# EAGLE design coolRoof_concentrateur_exterieur (EAGLE 8.4.0)
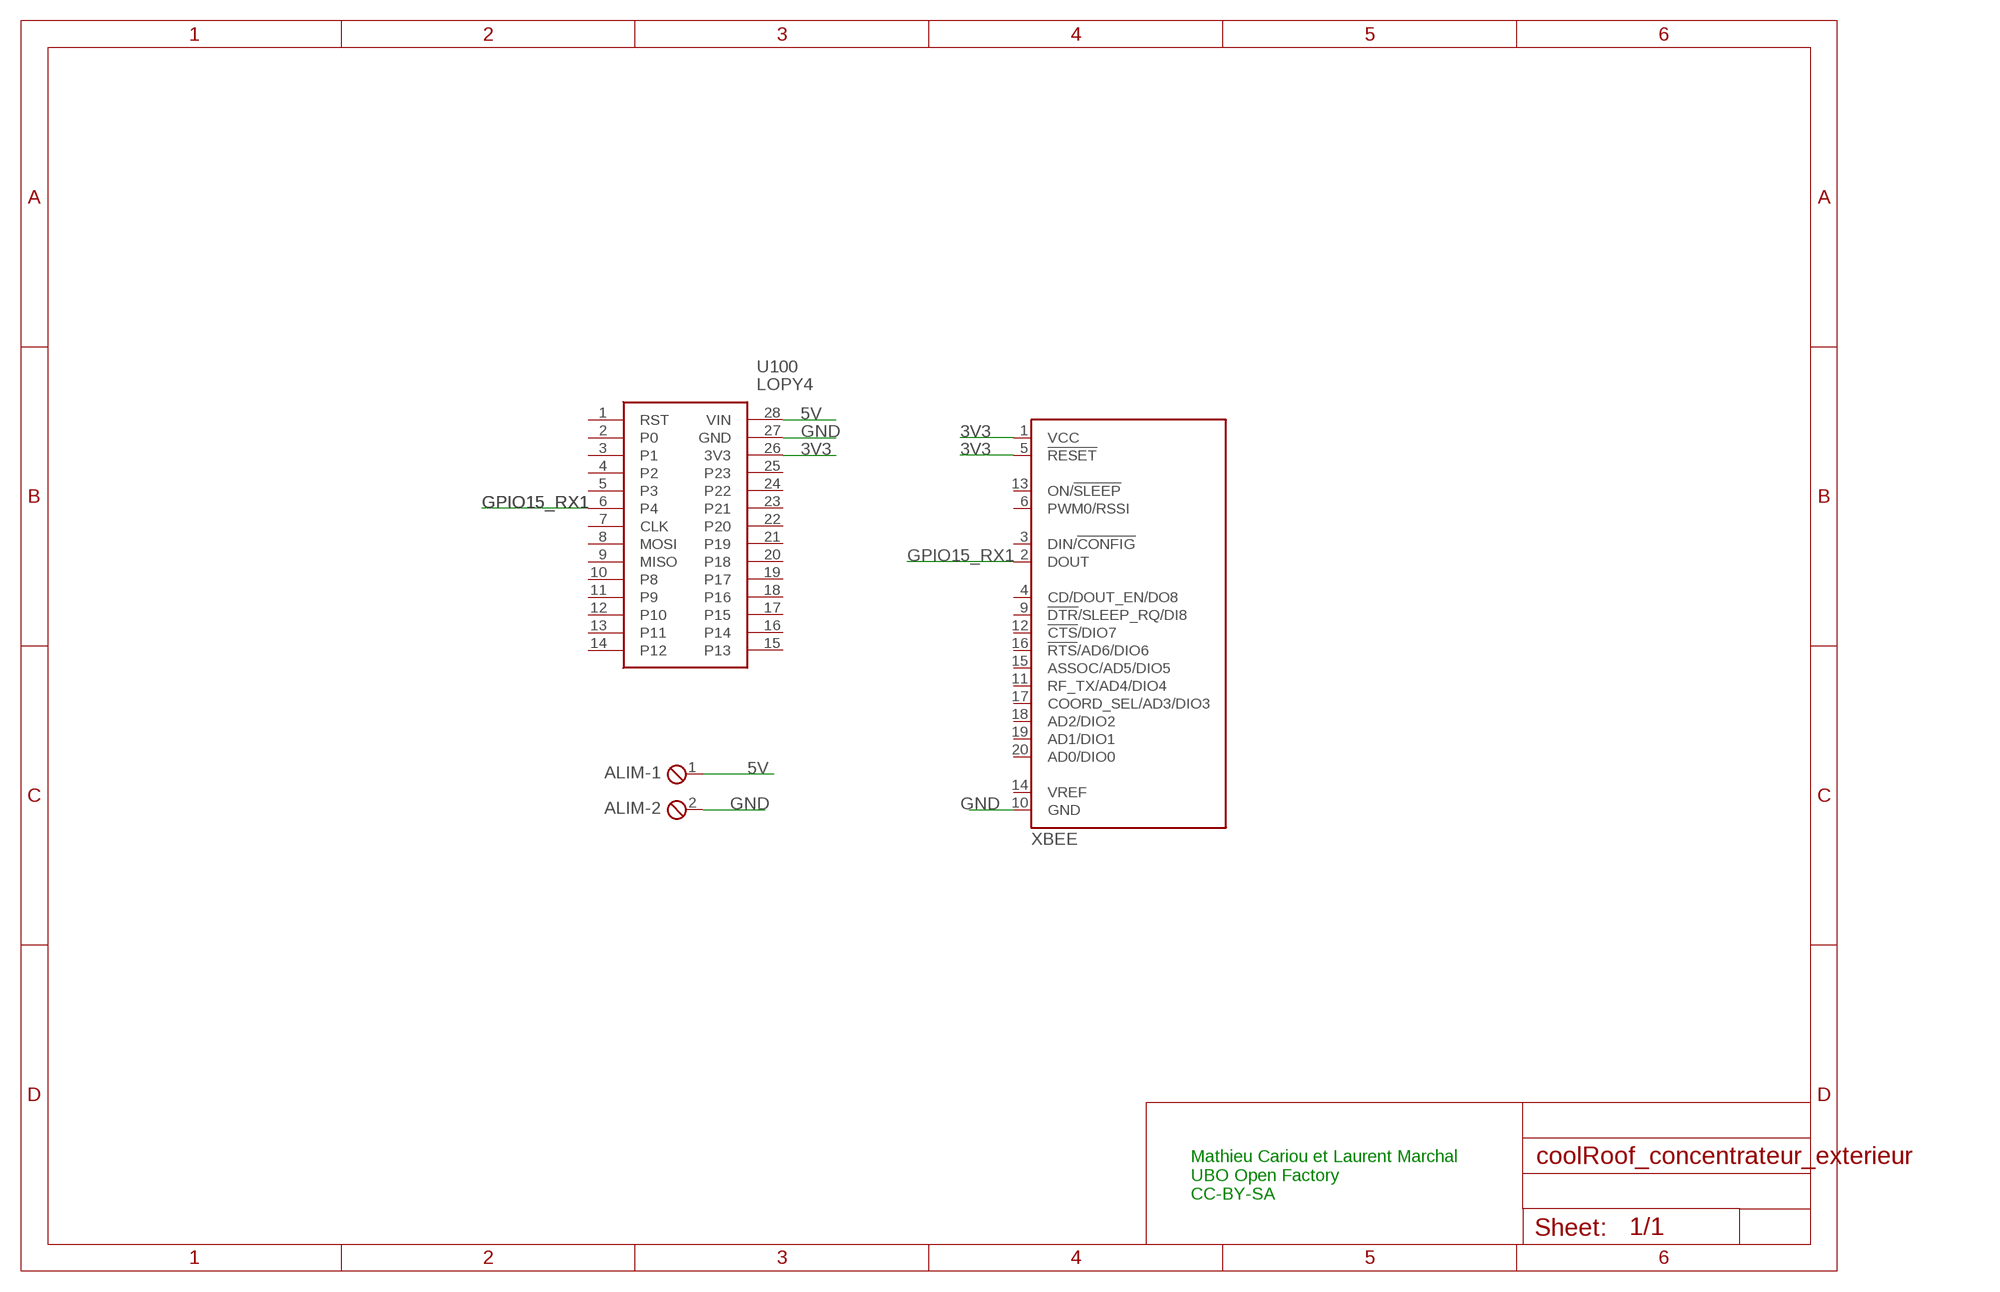
[diagram p0: schematic, sheet 1]

## Parts
ALIM  MPT2  [2POL254]
U100  LOPY4  [LOPY4]
U101  XBEE  [XBEE]

## Nets
3V3: U100.26(3V3) U101.1(VCC) U101.5(!RESET)
5V: ALIM.1 U100.28(VIN)
GND: ALIM.2 U100.27(GND) U101.10(GND)
GPIO15_RX1: U100.6(P4) U101.2(DOUT)
Unconnected: U100.1(RST) U100.2(P0) U100.3(P1) U100.4(P2) U100.5(P3) U100.7(CLK) U100.8(MOSI) U100.9(MISO) U100.10(P8) U100.11(P9) U100.12(P10) U100.13(P11) U100.14(P12) U100.15(P13) U100.16(P14) U100.17(P15) U100.18(P16) U100.19(P17) U100.20(P18) U100.21(P19) U100.22(P20) U100.23(P21) U100.24(P22) U100.25(P23) U101.3(DIN/!CONFIG) U101.4(CD/DOUT_EN/DO8) U101.6(PWM0/RSSI) U101.9(!DTR!/SLEEP_RQ/DI8) U101.11(RF_TX/AD4/DIO4) U101.12(!CTS!/DIO7) U101.13(ON/!SLEEP) U101.14(VREF) U101.15(ASSOC/AD5/DIO5) U101.16(!RTS!/AD6/DIO6) U101.17(COORD_SEL/AD3/DIO3) U101.18(AD2/DIO2) U101.19(AD1/DIO1) U101.20(AD0/DIO0)

## Notes on the sheet
- Mathieu Cariou et Laurent Marchal
  UBO Open Factory
  CC-BY-SA

## Library data of the parts
ALIM = con-phoenix-254:MPT2: PHOENIX CONNECTOR; OC_FARNELL: unknown; OC_NEWARK: unknown
U100 = Eagle_UOF_Lib:LOPY4: Pycom Pycom LoPy4 Bluetooth Smart (BLE), LoRa, SigFox, WiFi Development Board Source: Datasheet <https://pycom.io/wp-content/uploads/2018/03/Pycom_Specsheet_LoPy4.pdf>; ARROW_PART_NUMBER: LOPY4; ARROW_PRICE-STOCK: https://www.arrow.com/en/products/lopy4/pycom-ltd; DESCRIPTION: Pycom Pycom LoPy4 Bluetooth Smart (BLE), LoRa, SigFox, WiFi Development Board; HEIGHT: 5mm; MANUFACTURER_NAME: Pycom; MANUFACTURER_PART_NUMBER: LOPY4; MOUSER_PART_NUMBER: 365-LOPY4; MOUSER_PRICE-STOCK: https://www.mouser.com/Search/Refine.aspx?Keyword=365-LOPY4
U101 = maxstream:XBEE: XBee (TM) /XBee-PRO(TM) OEM RF Modules Source: MaxStream, Inc. xbee_productmanual.pdf; MPN: XBP24-Z7UIT-004; OC_FARNELL: 1751799; OC_NEWARK: 34R5507

## Board
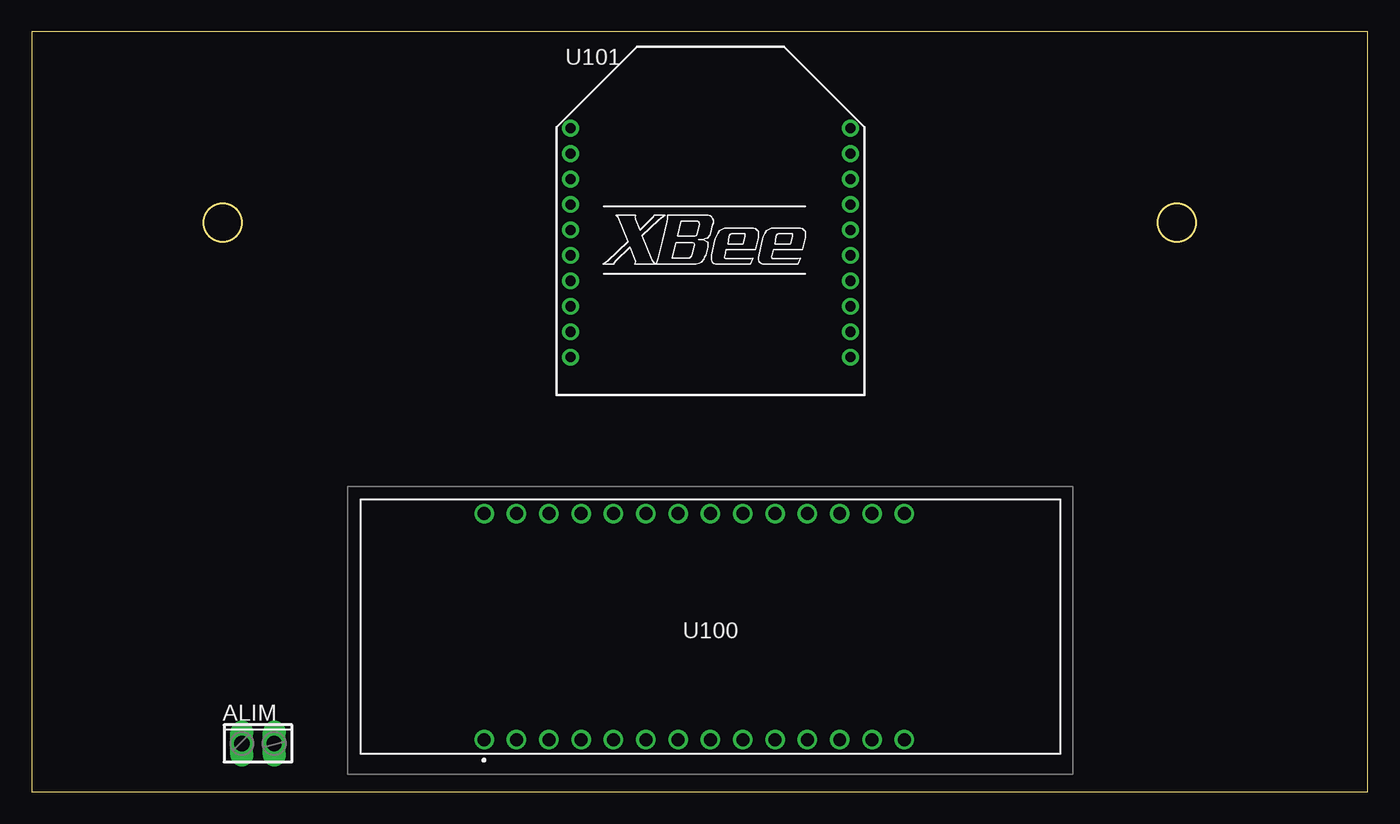
[diagram p1: board, top side]
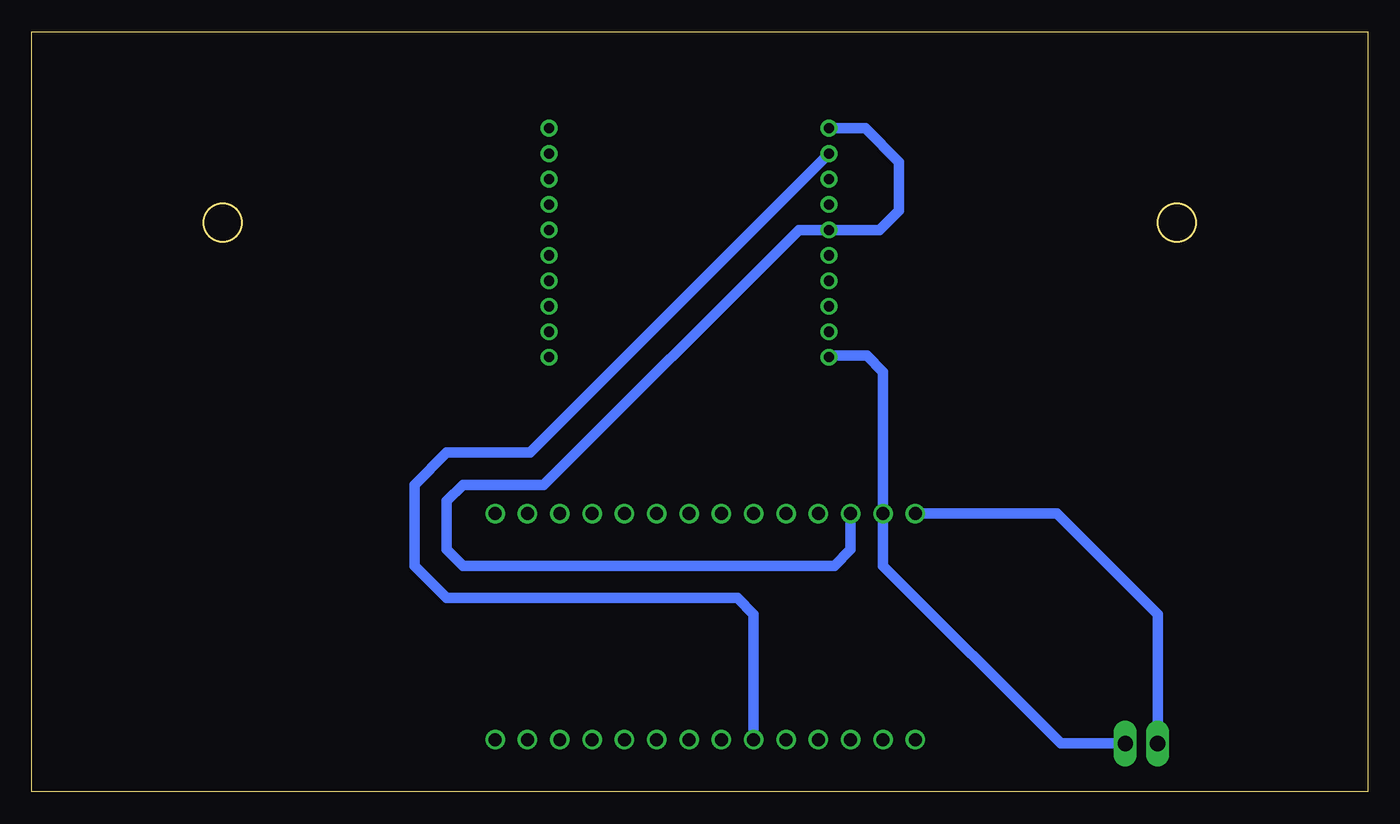
[diagram p2: board, bottom side, seen from below]

Size 105 x 59.76 mm. Coordinates in mm from the lower left corner, seen from the top.
Outline: 0,0 105,0 105,59.76 0,59.76 0,0
Outline: circle at 15,44.76 radius 1.5
Outline: circle at 90,44.76 radius 1.5
Copper layers (1*16): Top 0.035mm / dielectric 1.5mm / Bottom 0.035mm
Design rules "default": minimum track width 6mil, minimum drill 0.35mm, track to track 6mil, track to pad 6mil, pad to pad 6mil, via to via 6mil, smd to smd 6mil, copper to edge 40mil, drill to drill 6mil, minimum pad ring 10mil, minimum via ring 8mil, stop-mask expansion 4mil, vias tented up to drill 0mil, thermal gap 10mil

### Footprints (pad centres in the part's own frame; a part is rotated, then mirrored left to right if it is on the bottom)
2POL254 = drill 1.2 long: 1 -1.27,0; 2 1.27,0
LOPY4 = drill 1.02 pad 1.53: 1 -17.78,-8.59; 2 -15.24,-8.59; 3 -12.7,-8.59; 4 -10.16,-8.59; 5 -7.62,-8.59; 6 -5.08,-8.59; 7 -2.54,-8.59; 8 0,-8.59; 9 2.54,-8.59; 10 5.08,-8.59; 11 7.62,-8.59; 12 10.16,-8.59; 13 12.7,-8.59; 14 15.24,-8.59; 15 15.24,9.19; 16 12.7,9.19; 17 10.16,9.19; 18 7.62,9.19; 19 5.08,9.19; 20 2.54,9.19; 21 0,9.19; 22 -2.54,9.19; 23 -5.08,9.19; 24 -7.62,9.19; 25 -10.16,9.19; 26 -12.7,9.19; 27 -15.24,9.19; 28 -17.78,9.19
XBEE = drill 0.8 pad 1.27: 1 -11,9; 2 -11,7; 3 -11,5; 4 -11,3; 5 -11,1; 6 -11,-1; 7 -11,-3; 8 -11,-5; 9 -11,-7; 10 -11,-9; 11 11,-9; 12 11,-7; 13 11,-5; 14 11,-3; 15 11,-1; 16 11,1; 17 11,3; 18 11,5; 19 11,7; 20 11,9

### Placement (x,y rotation side)
ALIM  17.78,3.81 0 top
U100  53.34,12.7 0 top
U101  53.34,43.18 0 top

### Tracks (layer width: path | path; a pad name or v marks a point on that pad's centre or on a via)
3V3
  Bottom 0.813: U100.26 40.64,19.05 41.91,17.78 71.12,17.78 72.39,19.05 72.39,22.86 71.12,24.13 64.77,24.13 44.72,44.18 U101.5 38.37,44.18 36.83,45.72 36.83,49.53 39.48,52.18 U101.1
5V
  Bottom 0.813: U100.28 24.43,21.89 16.51,13.97 ALIM.1
GND
  Bottom 0.813: ALIM.2 24.13,3.81 38.1,17.78 38.1,21.59 U100.27 38.1,33.02 39.37,34.29 42.23,34.29 U101.10
GPIO15_RX1
  Bottom 0.813: U100.6 48.26,13.97 49.53,15.24 72.39,15.24 74.93,17.78 74.93,24.13 72.39,26.67 65.85,26.67 U101.2